# EAGLE schematic ESP32_PZEM_Relay_LoRa (EAGLE 9.6.2)
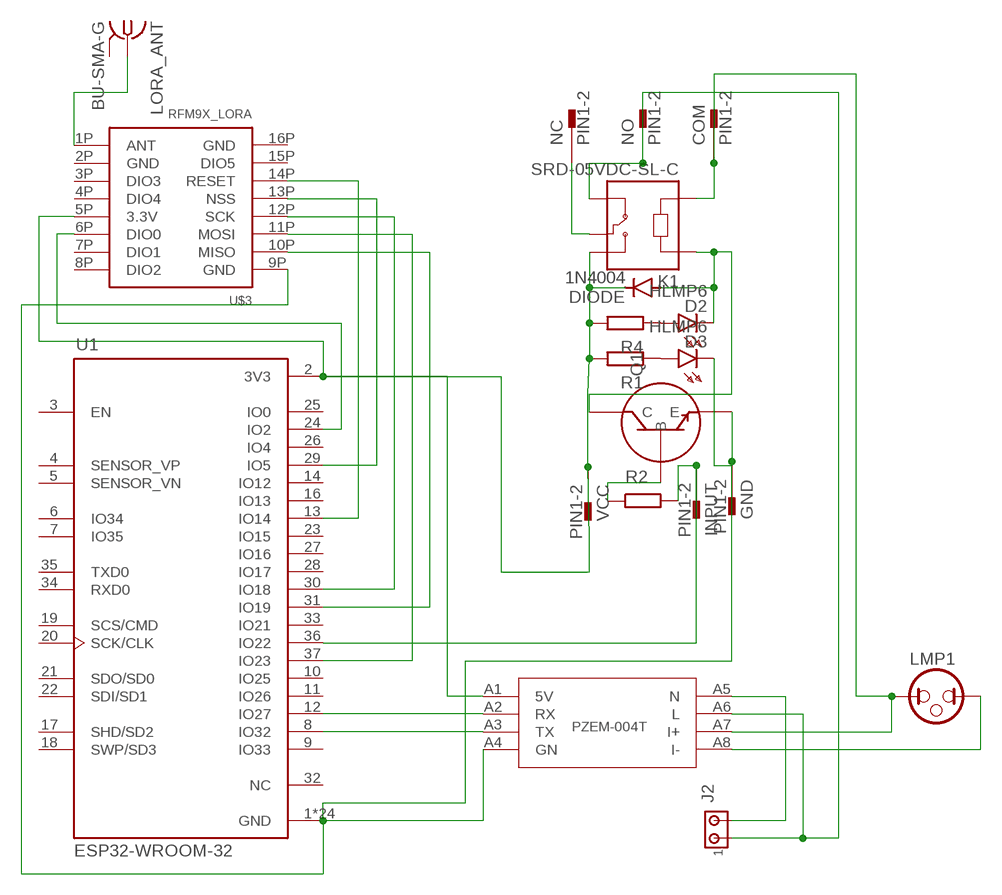
[diagram p0: schematic, sheet 1]

## Parts
COM  PIN1-2  [62221]
D2  HLMP6  [HLMP6]
D3  HLMP6  [HLMP6]
DIODE  1N4004  [DO41-10]
GND  PIN1-2  [62221]
INPUT  PIN1-2  [62221]
J2  MTA02-100  [10X02MTA]
K1  SRD-05VDC-SL-C  [RELAY_SRD-05VDC-SL-C]
LMP1  NEON  [LDH-3R]
LORA_ANT  BU-SMA-G  [BU-SMA-G]
NC  PIN1-2  [62221]
NO  PIN1-2  [62221]
Q1  BJT_NPN  (no package)
R1  R  (no package)
R2  R  (no package)
R4  R  (no package)
U1  ESP32-WROOM-32  [MODULE_ESP32-WROOM-32]
U$2  PZEM  [PZEM_FOOTPRINT]
U$3  RFM9X_LORA  [RFM9X_SMT]
VCC  PIN1-2  [62221]

## Nets
N$1: Q1.B R2.1
N$2: INPUT.1 R2.2 U1.36(IO22)
N$3: J2.2 U$2.A5(N)
N$4: J2.1 K1.NC NO.1 U$2.A6(L)
N$5: D3.A R1.1
N$6: D2.A R4.1
N$8: K1.COM NC.1
N$9: DIODE.C K1.NO R1.2 R4.2 U1.2(3V3) U$2.A1(5V) U$3.5P(3.3V) VCC.1
N$10: COM.1 K1.A2 LMP1.1 U$2.A7(I+)
N$11: LORA_ANT.1 U$3.1P(ANT)
N$12: D2.K DIODE.A K1.A1 Q1.C
N$13: D3.K GND.1 Q1.E U1.1(GND) U1.15(GND) U1.38(GND) U1.39_1(GND) U1.39_2(GND) U1.39_3(GND) U1.39_4(GND) U1.39_5(GND) U1.39_6(GND) U1.39_7(GND) U1.39_8(GND) U1.39_9(GND) U1.39_10(GND) U1.39_11(GND) U1.39_12(GND) U1.39_13(GND) U1.39_14(GND) U1.39_15(GND) U1.39_16(GND) U1.39_17(GND) U1.39_18(GND) U1.39_19(GND) U1.39_20(GND) U1.39_21(GND) U$2.A4(GN) U$3.9P(GND)
N$14: U1.24(IO2) U$3.6P(DIO0)
N$15: U1.13(IO14) U$3.14P(RESET)
N$16: U1.29(IO5) U$3.13P(NSS)
N$17: U1.30(IO18) U$3.12P(SCK)
N$18: U1.37(IO23) U$3.11P(MOSI)
N$19: U1.31(IO19) U$3.10P(MISO)
N$20: LMP1.2 U$2.A8(I-)
N$22: U1.12(IO27) U$2.A2(RX)
N$23: U1.8(IO32) U$2.A3(TX)
Unconnected: LORA_ANT.2 LORA_ANT.3 LORA_ANT.4 LORA_ANT.5 U1.3(EN) U1.4(SENSOR_VP) U1.5(SENSOR_VN) U1.6(IO34) U1.7(IO35) U1.9(IO33) U1.10(IO25) U1.11(IO26) U1.14(IO12) U1.16(IO13) U1.17(SHD/SD2) U1.18(SWP/SD3) U1.19(SCS/CMD) U1.20(SCK/CLK) U1.21(SDO/SD0) U1.22(SDI/SD1) U1.23(IO15) U1.25(IO0) U1.26(IO4) U1.27(IO16) U1.28(IO17) U1.32(NC) U1.33(IO21) U1.34(RXD0) U1.35(TXD0) U$3.2P(GND) U$3.3P(DIO3) U$3.4P(DIO4) U$3.7P(DIO1) U$3.8P(DIO2) U$3.15P(DIO5) U$3.16P(GND)

## Library data of the parts
COM GND INPUT NC NO VCC = con-faston:PIN1-2: CONN TAB FASTON BRASS .187 PCB TAB, FSSTON, DUAL STAKE, .187 SERIES Digi-Key Part Number: A24734CT-ND Source: Tyco Electronics Corporation .. ENG_CD_62221_R.pdf http://search.digikey.com/scripts/DkSearch/dksus.dll?Detail&name=A24734CT-ND; MF: TYCO ELECTRONICS; MPN: 62221-1; OC_FARNELL: unknown; OC_NEWARK: 16H2318
D2 D3 = display-hp:HLMP6: LED 2mm horizontal; MF: AGILENT TECHNOLOGIES; MPN: HLMP-6500; OC_FARNELL: 1652490; OC_NEWARK: 40K0088
DIODE = diode:1N4004: DIODE general purpose rectifier, 1 A
J2 = con-amp:MTA02-100: AMP connector
K1 = SRD-05VDC-SL-C:SRD-05VDC-SL-C: 5V Trigger Relay Module For Arduino And Raspberry Pi 5V Trigger Relay Module For Arduino And Raspberry Pi Check availability <https://pricing.snapeda.com/parts/SRD-05VDC-SL-C/Songle%20Relay/view-part?ref=eda>; AVAILABILITY: Not in stock; DESCRIPTION: 5V Trigger Relay Module For Arduino And Raspberry Pi 5V Trigger Relay Module For Arduino And Raspberry Pi; MF: Songle Relay; MP: SRD-05VDC-SL-C; PACKAGE: None; PRICE: None
LMP1 = special:NEON: Neon LAMP
LORA_ANT = con-coax:BU-SMA-G: FEMALE SMA CONNECTOR Radiall distributor RS 193-9117; OC_FARNELL: unknown; OC_NEWARK: unknown
Q1 = ngspice-simulation:BJT_NPN: Bipolar NPN Transistor
R1 R2 R4 = ngspice-simulation:R: RESISTOR
U1 = ESP32-WROOM-32:ESP32-WROOM-32: Check availability <https://pricing.snapeda.com/parts/ESP32-WROOM-32/Espressif%20Systems/view-part?ref=eda>; AVAILABILITY: In Stock; DESCRIPTION: Bluetooth, WiFi 802.11b/g/n, Bluetooth v4.2 +EDR, Class 1, 2 and 3 Transceiver Module 2.4GHz ~ 2.5GHz Antenna Not Included, U.FL Surface Mount; MF: Espressif Systems; MP: ESP32-WROOM-32; PACKAGE: Module Espressif Systems; PRICE: None; PURCHASE-URL: https://pricing.snapeda.com/search/part/ESP32-WROOM-32/?ref=eda
U$2 = pzem:PZEM
U$3 = altro:RFM9X_LORA: HopeRF RFM95/96/97/98 LoRa Module